# EAGLE design ESP8266LEDBoard (EAGLE 9.2.2)
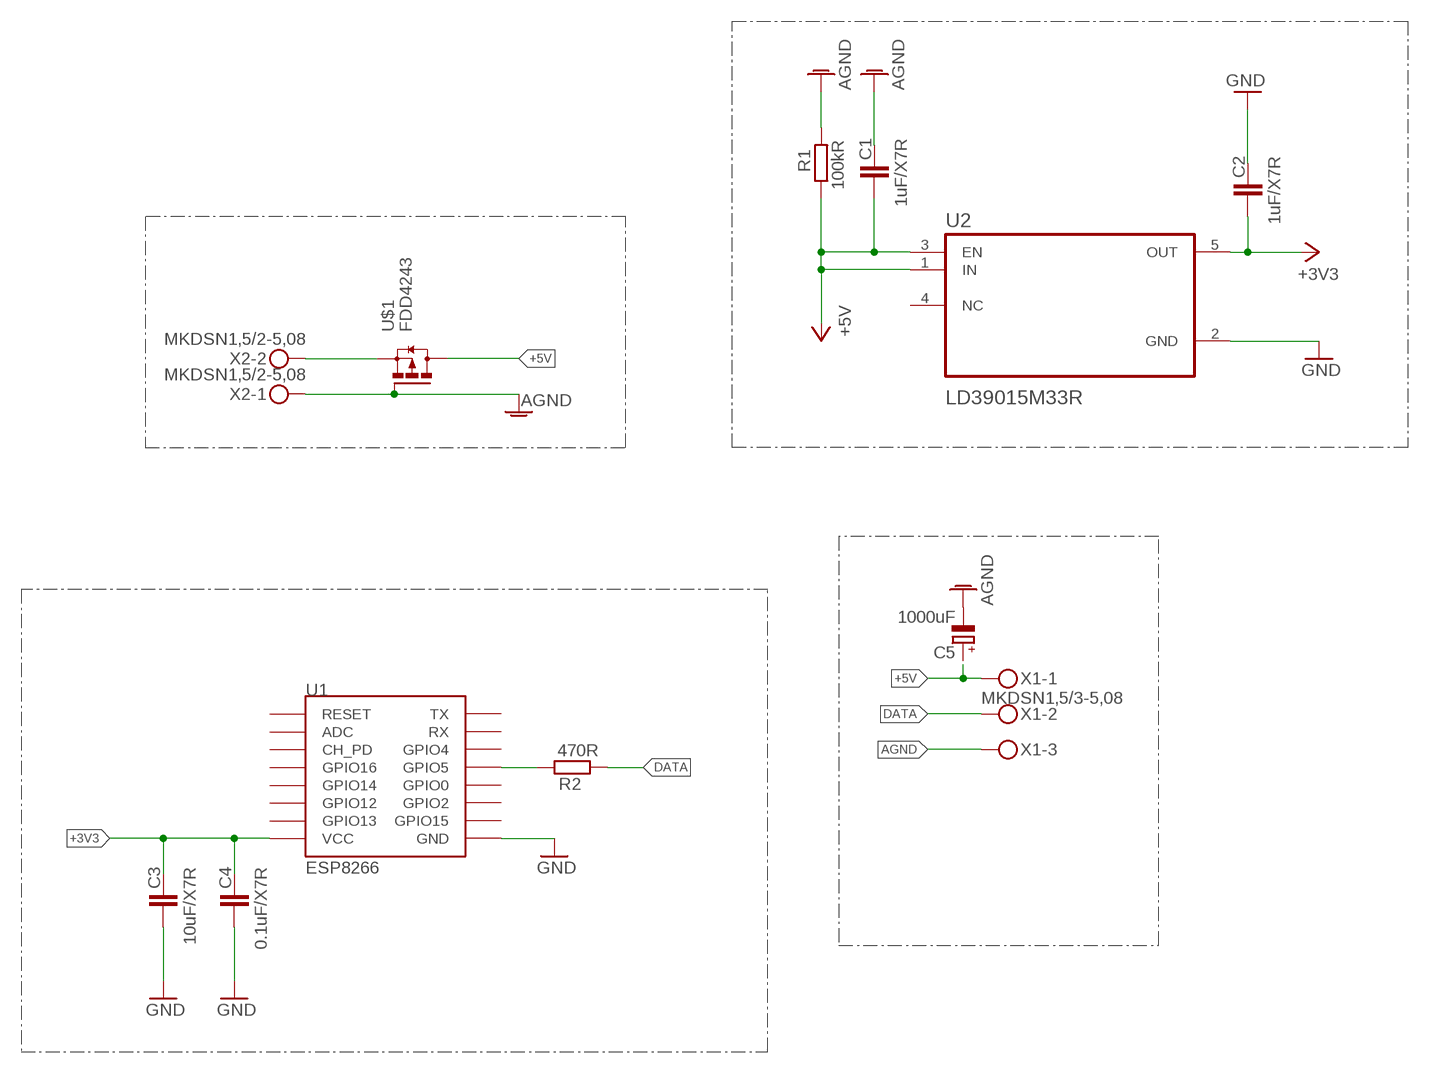
[diagram p0: schematic, sheet 1]

## Parts
C1  1uF/X7R  C-EUC0805  [C0805]
C2  1uF/X7R  C-EUC0805  [C0805]
C3  10uF/X7R  C-EUC0805  [C0805]
C4  0.1uF/X7R  C-EUC0805  [C0805]
C5  1000uF  CPOL-EUUD-8X10  [UD-8X10_NICHICON]
R1  100kR  R-EU_R0805  [R0805]
R2  470R  R-EU_R0805  [R0805]
U1  ESP8266  ESP12SMD  [ESP12-SMD]
U2  LD39015M33R  [SOT95P280X145-5N]
U$1  FDD4243  [TO252]
X1  MKDSN1,5/3-5,08  [MKDSN1,5/3-5,08]
X2  MKDSN1,5/2-5,08  [MKDSN1,5/2-5,08]

## Nets
+3V3: C2.1 C3.2 C4.2 U1.VCC U2.5(OUT)
+5V: C1.1 C5.+ R1.1 U2.1(IN) U2.3(EN) U$1.3(D) X1.1
AGND: C1.2 C5.- R1.2 U$1.1(G) X1.3 X2.1
DATA: R2.1 X1.2
GND: C2.2 C3.1 C4.1 U1.GND U2.2(GND)
N$1: U$1.2(S) X2.2
N$2: R2.2 U1.GPIO5
Unconnected: U1.ADC U1.CH_PD U1.GPIO0 U1.GPIO2 U1.GPIO4 U1.GPIO12 U1.GPIO13 U1.GPIO14 U1.GPIO15 U1.GPIO16 U1.RESET U1.RXD0(RX) U1.TXD0(TX) U2.4(NC)

## Library data of the parts
C1-C4 = rcl:C-EU: CAPACITOR, European symbol; SPICEPREFIX: C
C5 = rcl:CPOL-EU: POLARIZED CAPACITOR, European symbol; SPICEPREFIX: C
R1 R2 = rcl:R-EU_: RESISTOR, European symbol; SPICEPREFIX: R
U1 = esp8266modules:ESP12: ESP8266 Wifi module 12
U2 = LD39015M33R:LD39015M33R: None; AVAILABILITY: Unavailable; DESCRIPTION: LD39015 Series 150 mA 3.3 V Fixed Low Noise LDO Voltage Regulator - SOT-23-5; MF: STMicroelectronics; MP: LD39015M33R; PACKAGE: SOT-23-5 STMicroelectronics; PRICE: None
U$1 = FDD4243:FDD4243; AVAILABILITY: Unavailable; DESCRIPTION: P-Channel 40 V 44 mOhm Surface Mount PowerTrench Mosfet TO-252-3; MF: ON Semiconductor; MP: FDD4243; PACKAGE: TO-252-3 ON Semiconductor; PRICE: None
X1 = con-phoenix-508:MKDSN1,5/3-5,08: MKDSN 1,5/ 3-5,08 Printklemme Nennstrom: 13,5 A Nennspannung: 250 V Rastermaß: 5,08 mm Polzahl: 3 Anschlussart: Schraubanschluss Montage: Löten Anschlussrichtung Leiter/Platine: 0 ° Artikelnummer: 1729131 Source: http://eshop.phoenixcontact.com .. 1729131.pdf
X2 = con-phoenix-508:MKDSN1,5/2-5,08: MKDSN 1,5/ 2-5,08 Printklemme Nennstrom: 13,5 A Nennspannung: 250 V Rastermaß: 5,08 mm Polzahl: 2 Anschlussart: Schraubanschluss Montage: Löten Anschlussrichtung Leiter/Platine: 0 ° Artikelnummer: 1729128 Source: http://eshop.phoenixcontact.com .. 1729128.pdf

## Board
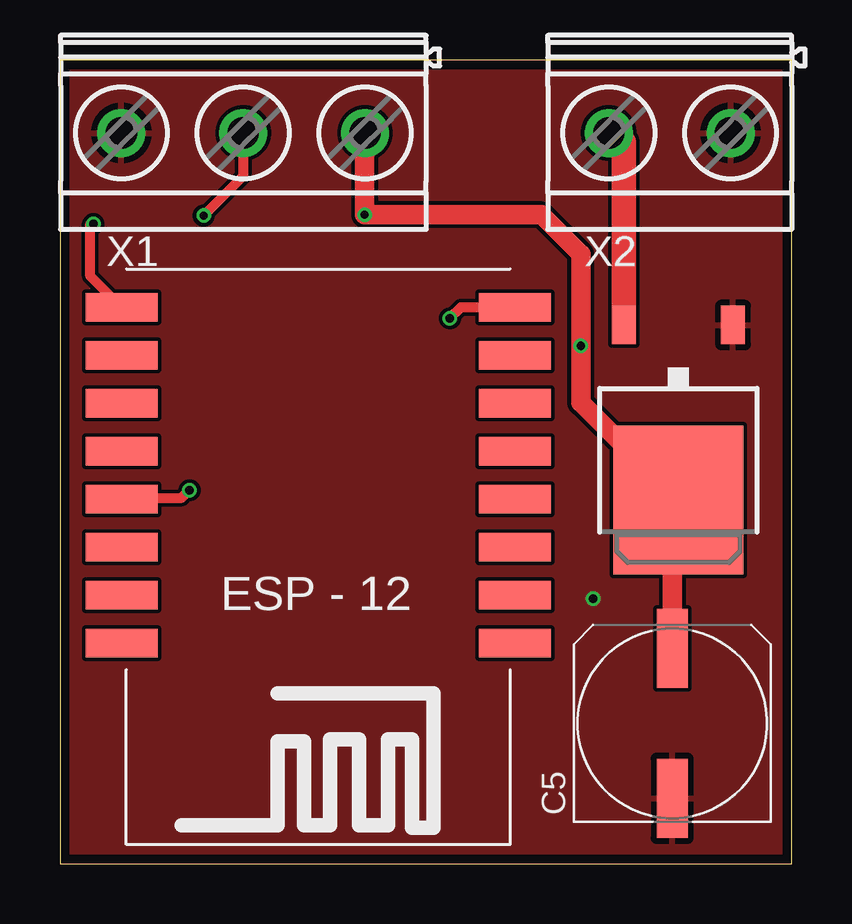
[diagram p1: board, top side]
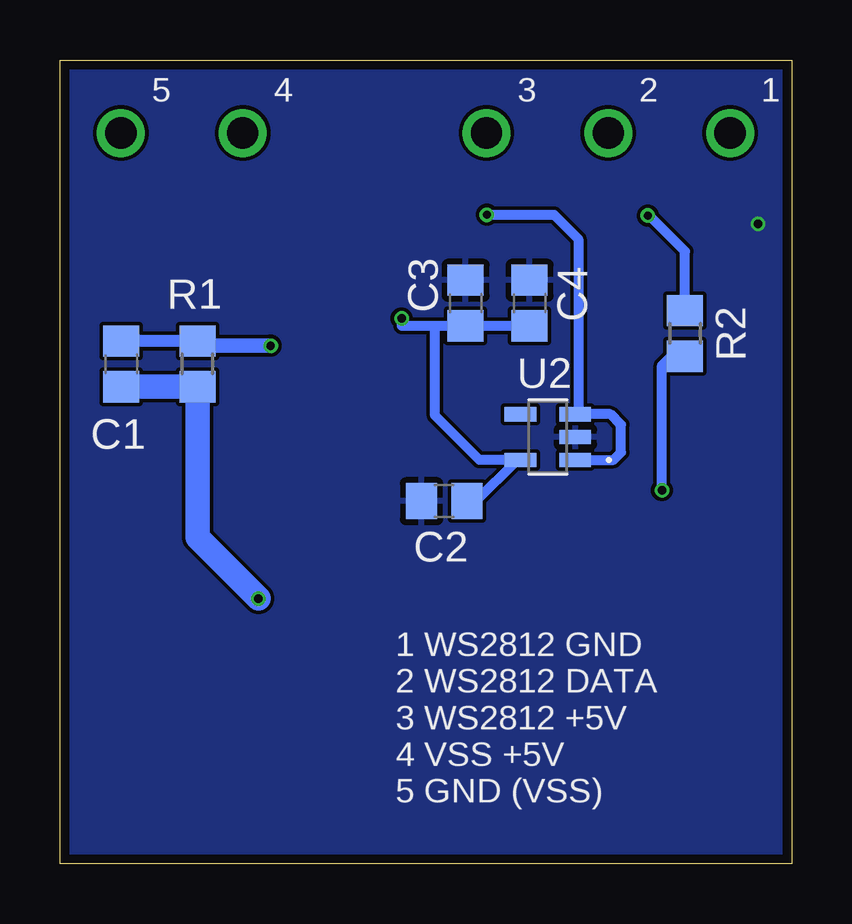
[diagram p2: board, bottom side, seen from below]

Size 30.5 x 33.5 mm. Coordinates in mm from the lower left corner, seen from the top.
Outline: 0,0 30.5,0 30.5,33.5 0,33.5 0,0
Copper layers (1*16): Top 0.035559375mm / dielectric 1.6mm / Bottom 0.035559375mm
Design rules "oshpark-2layer": minimum track width 6mil, minimum drill 10mil, track to track 6mil, track to pad 6mil, pad to pad 6mil, via to via 6mil, smd to smd 6mil, copper to edge 15mil, drill to drill 6mil, minimum pad ring 5mil, minimum via ring 5mil, stop-mask expansion 2.5mil, vias tented up to drill 0mil, thermal gap 10mil

### Footprints (pad centres in the part's own frame; a part is rotated, then mirrored left to right if it is on the bottom)
C0805 = smd 1.3 x 1.5: 1 -0.95,0; 2 0.95,0
UD-8X10_NICHICON = smd 3.3 x 1.3: + 3.125,0; - -3.125,0
R0805 = smd 1.3 x 1.5: 1 -0.95,0; 2 0.95,0
ESP12-SMD = smd 3 x 1.2: ADC -8.3,3.8; CH_PD -8.3,1.8; GND 8.1,-8.2; GPIO0 8.1,-2.2; GPIO2 8.1,-4.2; GPIO4 8.1,1.8; GPIO5 8.1,-0.2; GPIO12 -8.3,-4.2; GPIO13 -8.3,-6.2; GPIO14 -8.3,-2.2; GPIO15 8.1,-6.2; GPIO16 -8.3,-0.2; RESET -8.3,5.8; RXD0 8.1,3.8; TXD0 8.1,5.8; VCC -8.3,-8.2
SOT95P280X145-5N = smd 1.32 x 0.59: 1 -1.145,0.95; 2 -1.145,0; 3 -1.145,-0.95; 4 1.145,-0.95; 5 1.145,0.95
TO252 = smd 1 x 1.6: 1 -2.28,-4.8; 2 2.28,-4.8 | smd 5.4 x 6.2: 3 0,2.5
MKDSN1,5/3-5,08 = drill 1.3 pad 2: 1 -7.641,0.025; 2 -2.561,0.025; 3 2.519,0.025
MKDSN1,5/2-5,08 = drill 1.3 pad 2: 1 -2.561,0.025; 2 2.519,0.025

### Placement (x,y rotation side)
C1  27.94,20.83 270 bottom
C2  14.48,15.11 180 bottom
C3  13.59,23.37 270 bottom
C4  10.92,23.37 270 bottom
C5  25.53,5.84 90 top
R1  24.77,20.83 270 bottom
R2  4.45,22.1 270 bottom
U1  10.67,14.99 180 top
U2  10.16,17.78 180 bottom
U$1  25.78,17.65 180 top
X1  5.08,30.48 180 top
X2  25.4,30.48 180 top

### Tracks (layer width: path | path; a pad name or v marks a point on that pad's centre or on a via)
+3V3  (via drill 0.35)
  Top 0.406: U1.VCC 16.71,23.19 v16.26,22.73
  Bottom 0.406: v16.26,22.73 16.26,22.42 14.86,22.42 | 14.86,22.42 C3.2 C4.2 | U2.5 11.43,16.83 | 11.43,16.83 13.02,16.83 14.86,18.67 14.86,22.42 | C2.1 13.15,15.11 11.43,16.83
+5V  (via drill 0.35)
  Top 0.813: X1.1 12.7,30.43 v12.7,27.05 20.07,27.05 21.72,25.4 v21.72,21.59 21.72,19.22 U$1.3 | 25.53,14.9 C5.+
  Top 1.016: 25.53,14.9 U$1.3
  Bottom 0.406: U2.1 7.43,16.83 7.11,17.14 7.11,18.29 7.55,18.73 U2.3 8.89,18.86 8.89,26.03 9.91,27.05 v12.7,27.05
  Bottom 0.508: R1.1 C1.1
  Bottom 0.61: R1.1 24.58,21.59 v21.72,21.59
AGND  (via drill 0.35)
  Bottom 1.016: C1.2 R1.2 24.77,13.59 v22.23,11.05
  pour Top: 0,0 0,33.5 30.5,33.5 30.5,0
DATA  (via drill 0.35)
  Top 0.406: X1.2 7.64,28.66 v5.99,27.01
  Bottom 0.406: R2.1 4.45,25.53 5.97,27.05 5.99,27.03 v5.99,27.01
GND  (via drill 0.35)
  Top 0.406: U1.GND 1.27,24.48 1.27,26.67 v1.39,26.67
  pour Bottom: 0,33.5 0,0 30.5,0 30.5,33.5
N$1
  Top 1.016: U$1.2 23.5,30.07 23.12,30.45 X2.2
N$2  (via drill 0.35)
  Top 0.406: U1.GPIO5 2.62,15.24 5.08,15.24 v5.4,15.56
  Bottom 0.406: v5.4,15.56 5.4,20.76 5.01,21.15 R2.2

### Text on the board
bNames: 1 | 2 | 3 | 4 | 5 | 1 WS2812 GND / 2 WS2812 DATA / 3 WS2812 +5V / 4 VSS +5V / 5 GND (VSS)